# EAGLE schematic psg-dual-electronic-switching (EAGLE 6.6.0)
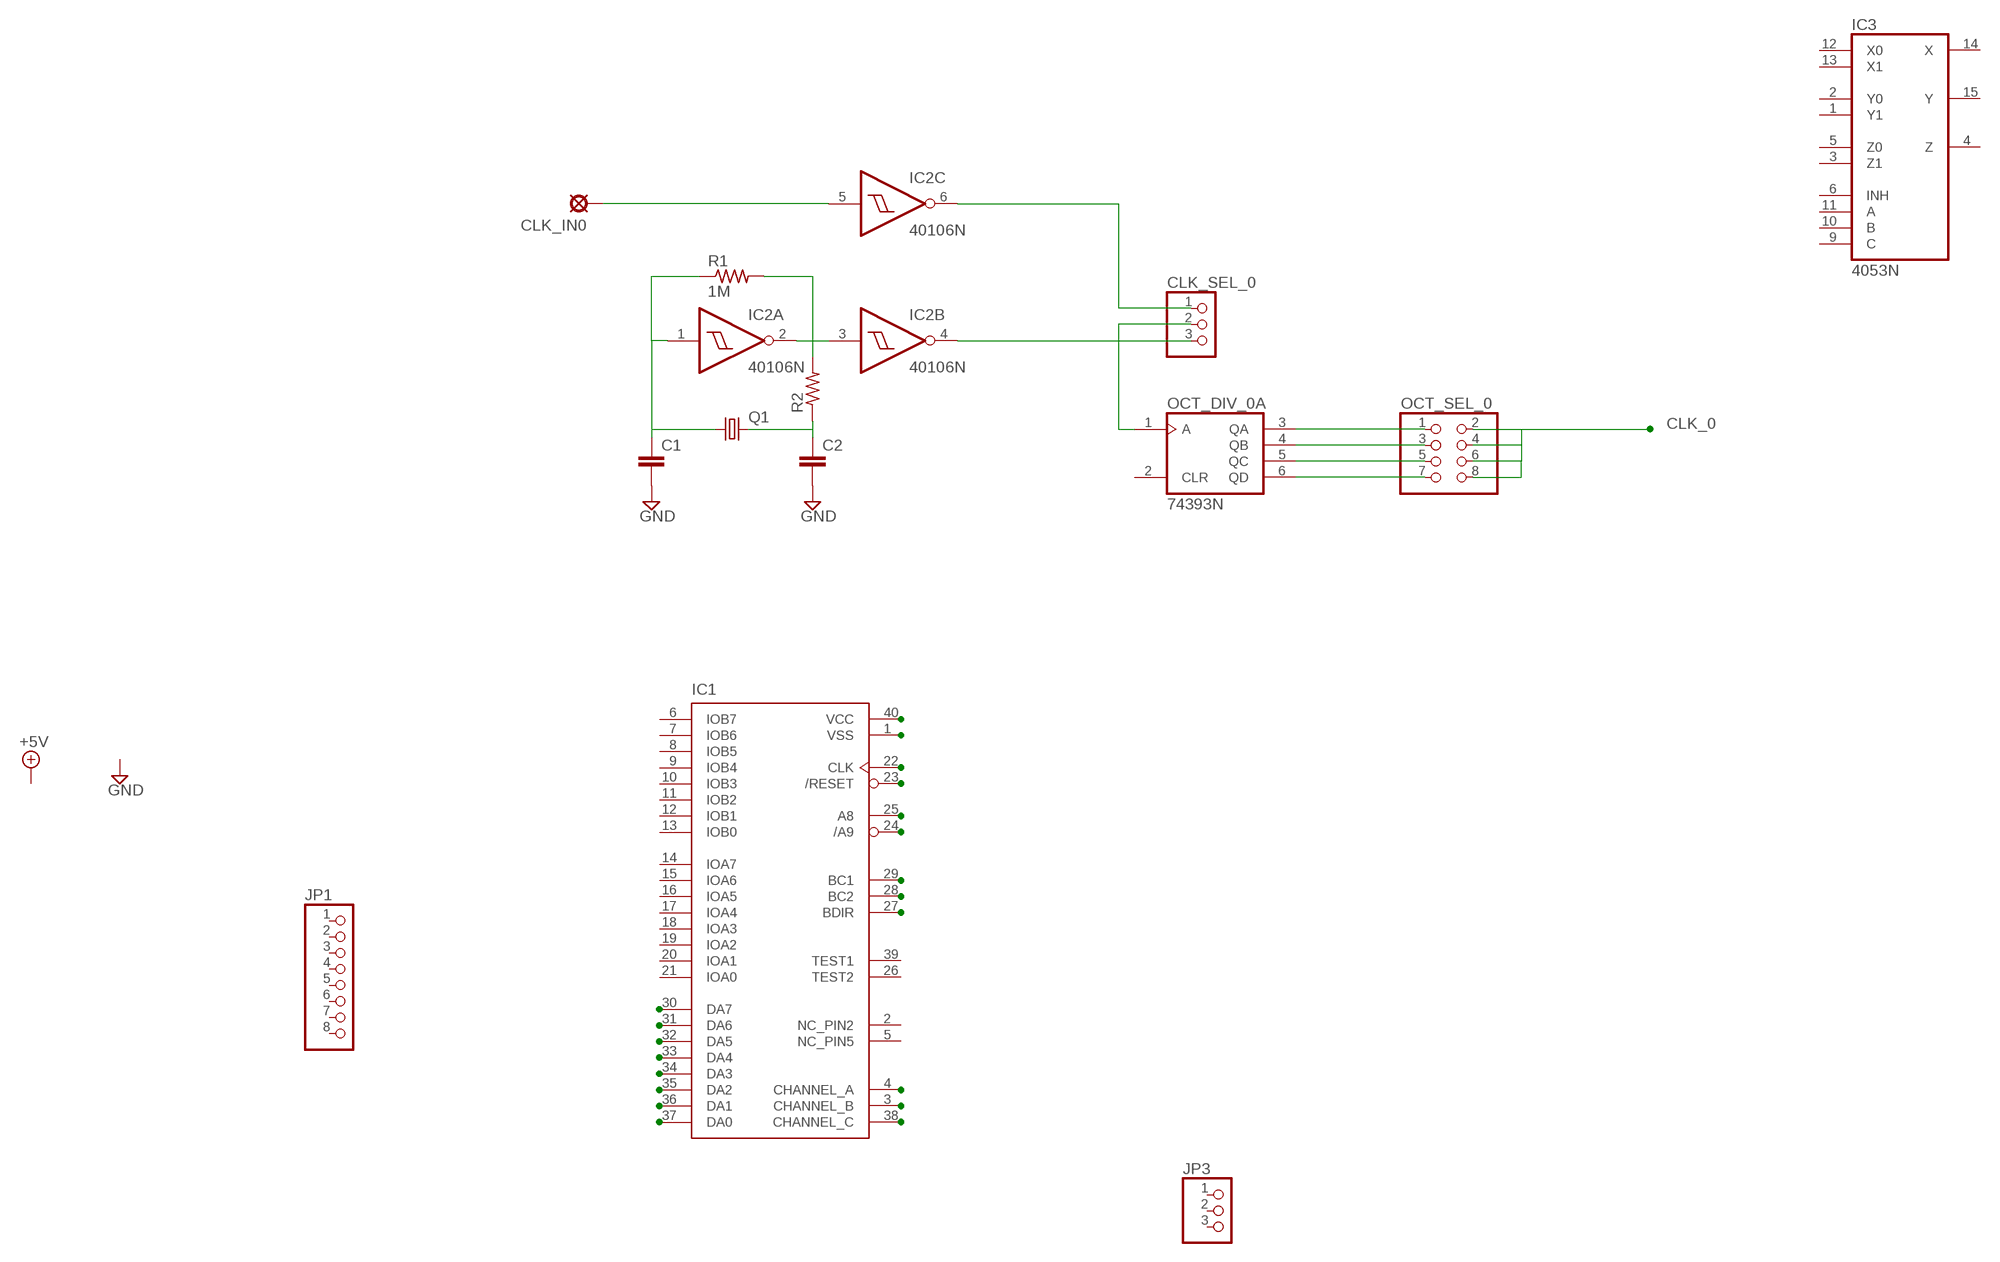
[diagram p0: schematic, sheet 1]

## Parts
C1  050X030_0252  [050X030_025_2]
C2  050X030_0252  [050X030_025_2]
CLK_IN0  PAD  [SQUARE]
CLK_SEL_0  PINHD-1X3  [1X03]
IC1  AY-3-8910  [DIL40]
IC2  40106N  [DIL14]
IC3  4053N  [DIL16]
JP1  PINHD-1X8  [1X08]
JP3  PINHD-1X3  [1X03]
OCT_DIV_0  74393N  [DIL14]
OCT_SEL_0  PINHD-2X4  [2X04]
Q1  CRYSTALHC18U-V  [HC18U-V]
R1  1M  6MM.3  [R0207/3]
R2  6MM.3  [R0207/3]

## Nets
CLK_0: OCT_SEL_0.2 OCT_SEL_0.4 OCT_SEL_0.6 OCT_SEL_0.8
GND: C1.2 C2.2
N$1: IC1.30(DA7)
N$2: IC1.31(DA6)
N$3: IC1.32(DA5)
N$4: IC1.33(DA4)
N$5: IC1.34(DA3)
N$6: IC1.35(DA2)
N$7: IC1.36(DA1)
N$8: IC1.37(DA0)
N$9: IC1.4(CHANNEL_A)
N$10: IC1.3(CHANNEL_B)
N$11: IC1.38(CHANNEL_C)
N$12: IC1.29(BC1)
N$13: IC1.28(BC2)
N$14: IC1.27(BDIR)
N$15: IC1.22(CLK)
N$16: IC1.23(/RESET)
N$17: IC1.1(VSS)
N$18: IC1.40(VCC)
N$19: IC1.25(A8)
N$20: IC1.24(/A9)
N$21: IC2.2(A:O) IC2.3(B:I) R1.2 R2.2
N$22: C2.1 Q1.2 R2.1
N$23: C1.1 IC2.1(A:I) Q1.1 R1.1
N$24: CLK_SEL_0.2 OCT_DIV_0.1(A:A)
N$25: CLK_SEL_0.3 IC2.4(B:O)
N$26: CLK_IN0.1(PAD) IC2.5(C:I)
N$27: OCT_DIV_0.3(A:QA) OCT_SEL_0.1
N$28: OCT_DIV_0.4(A:QB) OCT_SEL_0.3
N$29: OCT_DIV_0.5(A:QC) OCT_SEL_0.5
N$30: OCT_DIV_0.6(A:QD) OCT_SEL_0.7
N$31: CLK_SEL_0.1 IC2.6(C:O)
Unconnected: IC1.2(NC_PIN2) IC1.5(NC_PIN5) IC1.6(IOB7) IC1.7(IOB6) IC1.8(IOB5) IC1.9(IOB4) IC1.10(IOB3) IC1.11(IOB2) IC1.12(IOB1) IC1.13(IOB0) IC1.14(IOA7) IC1.15(IOA6) IC1.16(IOA5) IC1.17(IOA4) IC1.18(IOA3) IC1.19(IOA2) IC1.20(IOA1) IC1.21(IOA0) IC1.26(TEST2) IC1.39(TEST1) IC2.8(D:O) IC2.9(D:I) IC2.10(E:O) IC2.11(E:I) IC2.12(F:O) IC2.13(F:I) IC3.1(Y1) IC3.2(Y0) IC3.3(Z1) IC3.4(Z) IC3.5(Z0) IC3.6(INH) IC3.9(C) IC3.10(B) IC3.11(A) IC3.12(X0) IC3.13(X1) IC3.14(X) IC3.15(Y) JP1.1 JP1.2 JP1.3 JP1.4 JP1.5 JP1.6 JP1.7 JP1.8 JP3.1 JP3.2 JP3.3 OCT_DIV_0.2(A:CLR) OCT_DIV_0.8(B:QD) OCT_DIV_0.9(B:QC) OCT_DIV_0.10(B:QB) OCT_DIV_0.11(B:QA) OCT_DIV_0.12(B:CLR) OCT_DIV_0.13(B:A)

## Power pins joined to a net without a drawn wire
GND: IC3.8(GND) OCT_DIV_0.7(P:GND)
VCC: IC3.16(VCC) OCT_DIV_0.14(P:VCC)
VDD: IC2.14(P:VDD)
VEE: IC3.7(VEE)
VSS: IC2.7(P:VSS)

## Library data of the parts
C1 C2 = gm-caps-ceramic:050X030_025: 47 - 120pF Xicon Ceramic Disc 2.5mm lead spacing
CLK_IN0 = gm-supply:PAD: PAD use this package for pads with any purpose, including input, output, send or return various pad shapes: round, square, octogonal, long, and long offset
CLK_SEL_0 JP3 = pinhead:PINHD-1X3: PIN HEADER
IC1 = 8Bit_Parts:AY-3-8910
IC2 = 40xx:40106: Hex SCHMITT TRIGGER
IC3 = 40xx:4053: Triple 2-channel ANALOG MULTIPLEXER
JP1 = pinhead:PINHD-1X8: PIN HEADER
OCT_DIV_0 = 74xx-us:74*393: Dual 4-bit decade and binary COUNTER
OCT_SEL_0 = pinhead:PINHD-2X4: PIN HEADER
Q1 = crystal:CRYSTAL: CRYSTAL; OC_FARNELL: unknown; OC_NEWARK: unknown
R1 R2 = gm-resistors:6MM: 6mm Resistors Leads spaced 1-6 holes apart for 0.1" perfboard. Suitable for 1/4 watt resistors.